# Altium schematic sheet Ethernet-PoE-Sheet.SchDoc (part 1 of 3)
size 420 x 297 mm; SheetNumber: 8; SheetTotal: 10
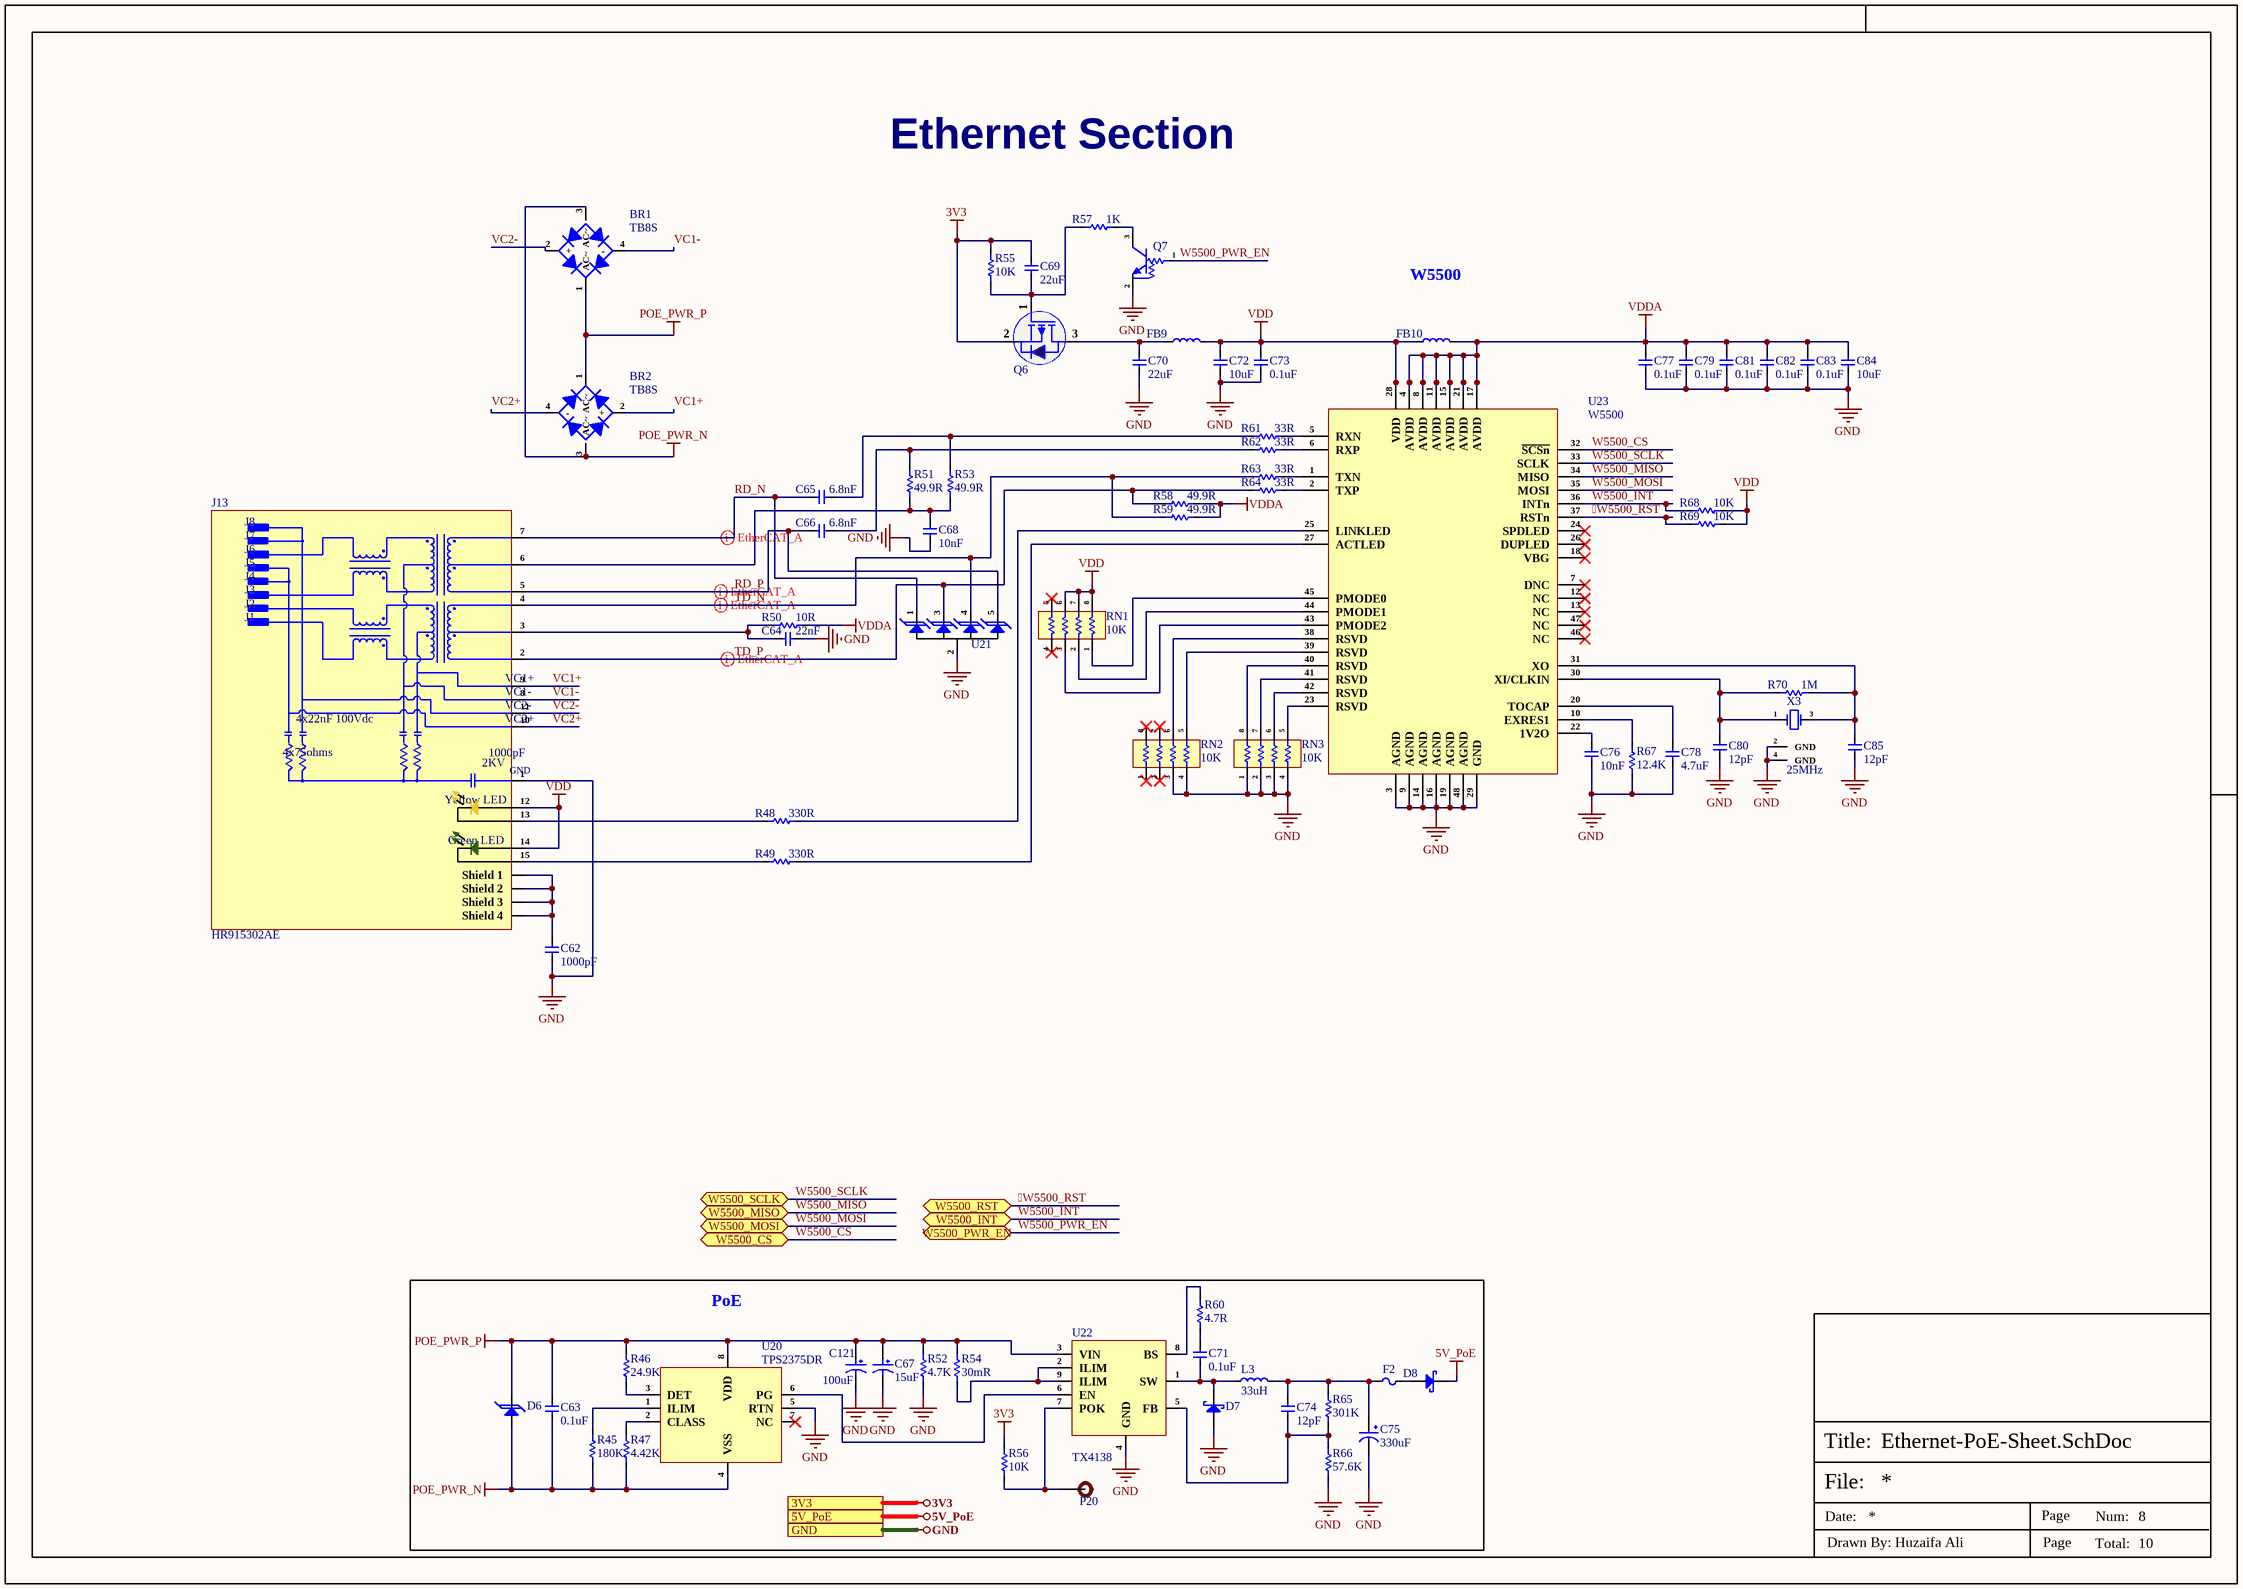
[diagram p0: Ethernet-PoE-Sheet.SchDoc]

## Parts
BR1  TB8S  [TB8S]
BR2  TB8S  [TB8S]
C62  1000pF  [Cap-1206]
C63  0.1uF  [Cap-0603]
C64  22nF  [Cap-0603]
C65  6.8nF  [Cap-0603]
C66  6.8nF  [Cap-0603]
C67  15uF  [VMMC0571J150MV]
C68  10nF  [Cap-0603]
C69  22uF  [Cap-0805]
C70  22uF  [Cap-0805]
C71  0.1uF  [Cap-0603]
C72  10uF  [Cap-0603]
C73  0.1uF  [Cap-0402]
C74  12pF  [Cap-0603]
C75  330uF  [Case-E]
C76  10nF  [Cap-0603]
C77  0.1uF  [Cap-0402]
C78  4.7uF  [Cap-0603]
C79  0.1uF  [Cap-0402]
C80  12pF  [Cap-0603]
C81  0.1uF  [Cap-0402]
C82  0.1uF  [Cap-0402]
C83  0.1uF  [Cap-0402]
C84  10uF  [Cap-0603]
C85  12pF  [Cap-0603]
C121  100uF  [VKMD1451K101MV]
D6  SMAJ58A  [SMA]  (value not drawn)
D7  SS510B  [SMB_]  (value not drawn)
D8  PMEG4030ER  [SOD-123FL]  (value not drawn)
F2  BSMD0805L-200  [Fuse-0805]  (value not drawn)
FB9  CBM201209U601T  [Ind-0805]  (value not drawn)
FB10  CBM201209U601T  [Ind-0805]  (value not drawn)
J13  HR915302AE  [HR915302AE]
L3  33uH  [CYH127-33UH]
P20  TEST POINT  [Test-point]  (value not drawn)
Q6  WPM2015-3/TR  [Sot-23]  (value not drawn)
Q7  LMUN2211LT1G  [SOT-23]  (value not drawn)
R45  180K  [Res-0603]
R46  24.9K  [Res-0603]
R47  4.42K  [Res-0603]
R48  330R  [Res-0603]
R49  330R  [Res-0603]
R50  10R  [Res-0603]
R51  49.9R  [Res-0603]
R52  4.7K  [Res-0603]
R53  49.9R  [Res-0603]
R54  30mR  [RES-0805]
R55  10K  [Res-0402]
R56  10K  [Res-0402]
R57  1K  [Res-0603]
R58  49.9R  [Res-0603]
R59  49.9R  [Res-0603]
R60  4.7R  [Res-0603]
R61  33R  [Res-0603]
R62  33R  [Res-0603]
R63  33R  [Res-0603]
R64  33R  [Res-0603]
R65  301K  [Res-0603]
R66  57.6K  [Res-0603]
R67  12.4K  [Res-0603]
R68  10K  [Res-0402]
R69  10K  [Res-0402]
R70  1M  [Res-0603]
RN1  10K  [YC164-FR-0710KL]
RN2  10K  [YC164-FR-0710KL]
RN3  10K  [YC164-FR-0710KL]
U20  TPS2375DR  [SOIC-8]
U21  SP0504BAHTG  [SOT-23-5]  (value not drawn)
U22  TX4138  [8-SOIC-EP]
U23  W5500  [48-LQFP (7x7)_]
X3  25MHz  [Q22FA12800090]

## Blocks framed on the sheet
PoE: C63 C67 C71 C74 C75 C121 D6-D8 F2 L3 P20 R45-R47 R52 R54 R56 R60 R65 R66 U20 U22

## Ports
3V3, 5V_PoE, GND, W5500_CS (bidir), W5500_INT (bidir), W5500_MISO (bidir), W5500_MOSI (bidir), W5500_PWR_EN (bidir), W5500_RST (bidir), W5500_SCLK (bidir)

## Nets
3V3: C69.2 Q6.2(S) R55.1 R56.2 ; port 3V3
5V_PoE: D8.1(K) ; port 5V_PoE
GND: C62.1 C64.2 C67.2 C68.1 C70.1 C72.1 C73.1 C75.2 C76.1 C77.1 C78.1 C79.1 C80.1 C81.1 C82.1 C83.1 C84.1 C85.1 C121.2 D7.1(A) J13.1(P1) Q7.2(E) R52.1 R66.1 R67.1 RN2.3 RN2.4 RN3.1 RN3.2 RN3.3 RN3.4 U20.5(RTN) U21.2(A) U22.4(GND) U23.3(AGND) U23.9(AGND) U23.14(AGND) U23.16(AGND) U23.19(AGND) U23.29(GND) U23.48(AGND) X3.2(GND) X3.4(GND) ; port GND
POE_PWR_N: BR1.3(AC~) BR2.3(AC~) C63.1 D6.2(K) R45.1 R47.1 U20.4(VSS)
POE_PWR_P: BR1.1(AC~) BR2.1(AC~) C63.2 C67.1 C121.1 D6.1(K) R46.2 R52.2 R54.2 U20.8(VDD) U22.3(VIN)
VDD: C72.2 C73.2 FB9.2 FB10.1 J13.12(ANODE) J13.14(ANODE) R68.1 R69.1 RN1.6 RN1.7 RN1.8 U23.28(VDD)
VDDA: C77.2 C79.2 C81.2 C82.2 C83.2 C84.2 FB10.2 R50.2 R58.2 R59.2 U23.4(AVDD) U23.8(AVDD) U23.11(AVDD) U23.15(AVDD) U23.17(AVDD) U23.21(AVDD)
W5500_RST: R69.2 U23.37(RSTn) ; port W5500_RST
RD_N: C65.1 J13.7(P7) U21.1(K)
RD_P: C66.1 J13.5(P5) U21.5(K)
TD_N: J13.4(P4) R59.1 R63.1 U21.4(K)
TD_P: J13.2(P2) R58.1 R64.1 U21.3(K)
VC1+: BR2.2(+) J13.9(VC1+)
VC1-: BR1.4(-) J13.8(VC1-)
VC2+: BR2.4(-) J13.10(VC2+)
VC2-: BR1.2(+) J13.11(VC2-)
W5500_CS: U23.32(~{SCSn}) ; port W5500_CS
W5500_INT: R68.2 U23.36(INTn) ; port W5500_INT
W5500_MISO: U23.34(MISO) ; port W5500_MISO
W5500_MOSI: U23.35(MOSI) ; port W5500_MOSI
W5500_PWR_EN: Q7.1(B) ; port W5500_PWR_EN
W5500_SCLK: U23.33(SCLK) ; port W5500_SCLK
NetC62_2: C62.2 J13.SH1(Shield_1) J13.SH2(Shield_2) J13.SH3(Shield_3) J13.SH4(Shield_4)
NetC64_1: C64.1 J13.3(P3) R50.1
NetC65_2: C65.2 R53.2 R61.1
NetC66_2: C66.2 R51.2 R62.1
NetC68_2: C68.2 J13.6(P6) R51.1 R53.1
NetC69_1: C69.1 Q6.1(G) R55.2 R57.1
NetC70_2: C70.2 FB9.1 Q6.3(D)
NetC71_1: C71.1 D7.2(K) L3.1 U22.1(SW)
NetC71_2: C71.2 R60.1
NetC74_1: C74.1 R65.1 R66.2 U22.5(FB)
NetC74_2: C74.2 C75.1 F2.1 L3.2 R65.2
NetC76_2: C76.2 U23.22(1V2O)
NetC78_2: C78.2 U23.20(TOCAP)
NetC80_2: C80.2 R70.1 U23.30(XI/CLKIN) X3.1(OSC1)
NetC85_2: C85.2 R70.2 U23.31(XO) X3.3(OSC2)
NetD8_2: D8.2(A) F2.2
NetJ13_13: J13.13(CATHODE) R48.1
NetJ13_15: J13.15(CATHODE) R49.1
NetP20_1: P20.1 R56.1 U22.7(POK)
NetQ7_3: Q7.3(C) R57.2
NetR45_2: R45.2 U20.1(ILIM)
NetR46_1: R46.1 U20.3(DET)
NetR47_2: R47.2 U20.2(CLASS)
NetR48_2: R48.2 U23.25(LINKLED)
NetR49_2: R49.2 U23.27(ACTLED)
NetR54_1: R54.1 U22.2(ILIM) U22.9(ILIM)
NetR60_2: R60.2 U22.8(BS)
NetR61_2: R61.2 U23.5(RXN)
NetR62_2: R62.2 U23.6(RXP)
NetR63_2: R63.2 U23.1(TXN)
NetR64_2: R64.2 U23.2(TXP)
NetR67_2: R67.2 U23.10(EXRES1)
NetRN1_1: RN1.1 U23.45(PMODE0)
NetRN1_2: RN1.2 U23.44(PMODE1)
NetRN1_3: RN1.3 U23.43(PMODE2)
NetRN2_5: RN2.5 U23.39(RSVD)
NetRN2_6: RN2.6 U23.38(RSVD)
NetRN3_5: RN3.5 U23.23(RSVD)
NetRN3_6: RN3.6 U23.42(RSVD)
NetRN3_7: RN3.7 U23.41(RSVD)
NetRN3_8: RN3.8 U23.40(RSVD)
NetU20_6: U20.6(PG) U22.6(EN)

Not connected (* = marked no-connect by the designer): RN1 4* 5*; RN2 1* 2* 7* 8*; U20 7(NC)*; U23 7(DNC)* 12(NC)* 13(NC)* 18(VBG)* 24(SPDLED)* 26(DUPLED)* 46(NC)* 47(NC)*

## Layout directives
differential pair; differential pair class Ethernet_Lines; net class Ethernet; rule Matched Net Lengths [Tolerance = 20mil]; rule Impedance Constraint [Min = 97.00    Max = 105.0    ]: RD_N, RD_P, TD_N, TD_P

## Notes on the sheet
- Ethernet Section
- W5500
- File:
- Title:
- Date:
- Page
- Num:
- Total:
- Drawn By: Huzaifa Ali
- (in symbol HR915302AE) J8; J7; J6; J5; J4; J3; J2; J1; 4x22nF 100Vdc; 4x75ohms; 1000pF; 2KV; GND; Yellow LED; Green LED